# Altium schematic sheet MCU.SchDoc
size A4; SheetNumber: 1; SheetTotal: 4
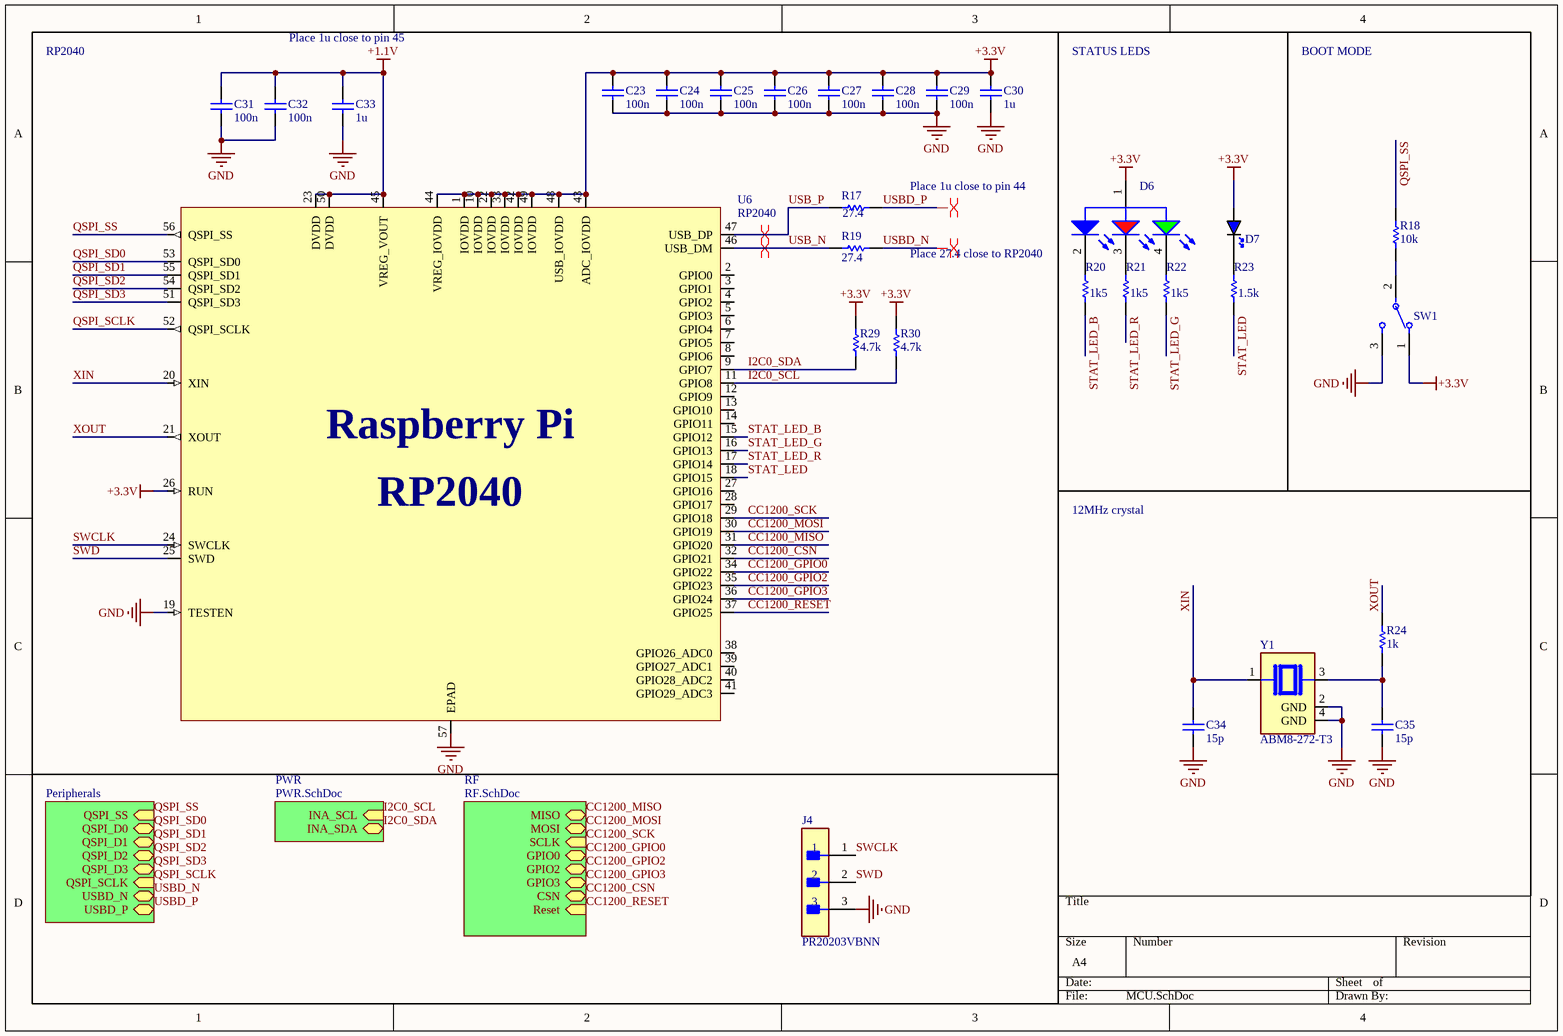
[diagram p0: MCU.SchDoc]

## Parts
C23  value 100n  [RES_0805]  (hidden comment: Capacitor)
C24  value 100n  [RES_0805]  (hidden comment: Capacitor)
C25  value 100n  [RES_0805]  (hidden comment: Capacitor)
C26  value 100n  [RES_0805]  (hidden comment: Capacitor)
C27  value 100n  [RES_0805]  (hidden comment: Capacitor)
C28  value 100n  [RES_0805]  (hidden comment: Capacitor)
C29  value 100n  [RES_0805]  (hidden comment: Capacitor)
C30  value 1u  [RES_0805]  (hidden comment: Capacitor)
C31  value 100n  [RES_0805]  (hidden comment: Capacitor)
C32  value 100n  [RES_0805]  (hidden comment: Capacitor)
C33  value 1u  [RES_0805]  (hidden comment: Capacitor)
C34  value 15p  [RES_0805]  (hidden comment: Capacitor)
C35  value 15p  [RES_0805]  (hidden comment: Capacitor)
D6  150141M173100  [WL-SFTW_3528_150141M173100]  (value not drawn)
D7  BLUE  [LED_0805_BLUE]  (value not drawn)
J4  PR20203VBNN  [FP-PR20203VBNN-MFG]
R17  value 27.4  [RES_0805]  (hidden comment: Resistor)
R18  value 10k  [RES_0603]  (hidden comment: Resistor)
R19  value 27.4  [RES_0805]  (hidden comment: Resistor)
R20  value 1k5  [RES_0805]  (hidden comment: Resistor)
R21  value 1k5  [RES_0805]  (hidden comment: Resistor)
R22  value 1k5  [RES_0805]  (hidden comment: Resistor)
R23  value 1.5k  [RES_0805]  (hidden comment: Resistor)
R24  value 1k  [RES_0805]  (hidden comment: Resistor)
R29  value 4.7k  [RES_0805]  (hidden comment: Resistor)
R30  value 4.7k  [RES_0805]  (hidden comment: Resistor)
SW1  JS102011SAQN  [FP-JS102011SAQN-MFG]  (value not drawn)
U6  RP2040  [QFN-56-EP]
Y1  ABM8-272-T3  [XTAL_ABM8-272-T3]

## Sub-sheets
Peripherals = Peripherals.SchDoc: QSPI_SS (in), QSPI_D0 (bidir), QSPI_D1 (bidir), QSPI_D2 (bidir), QSPI_SCLK (in), QSPI_D3 (bidir), USBD_N (bidir), USBD_P (bidir)
PWR = PWR.SchDoc: INA_SCL (in), INA_SDA (bidir)
RF = RF.SchDoc: MISO (bidir), MOSI (bidir), SCLK (in), GPIO0 (bidir), GPIO2 (bidir), GPIO3 (bidir), CSN (bidir), Reset (in)

## Nets
+1.1V: C31.1 C32.1 C33.1 U6.23(DVDD) U6.45(VREG_VOUT) U6.50(DVDD)
+3.3V: C23.1 C24.1 C25.1 C26.1 C27.1 C28.1 C29.1 C30.1 D6.1(A) D7.A R29.2 R30.2 SW1.1 U6.1(IOVDD) U6.10(IOVDD) U6.22(IOVDD) U6.26(RUN) U6.33(IOVDD) U6.42(IOVDD) U6.43(ADC_IOVDD) U6.44(VREG_IOVDD) U6.48(USB_IOVDD) U6.49(IOVDD)
GND: C23.2 C24.2 C25.2 C26.2 C27.2 C28.2 C29.2 C30.2 C31.2 C32.2 C33.2 C34.2 C35.2 J4.3 SW1.3 U6.19(TESTEN) U6.57(EPAD) Y1.2(GND) Y1.4(GND)
CC1200_CSN: U6.32(GPIO21) ; sheet RF/CSN
CC1200_GPIO0: U6.34(GPIO22) ; sheet RF/GPIO0
CC1200_GPIO2: U6.35(GPIO23) ; sheet RF/GPIO2
CC1200_GPIO3: U6.36(GPIO24) ; sheet RF/GPIO3
CC1200_MISO: U6.31(GPIO20) ; sheet RF/MISO
CC1200_MOSI: U6.30(GPIO19) ; sheet RF/MOSI
CC1200_RESET: U6.37(GPIO25) ; sheet RF/Reset
CC1200_SCK: U6.29(GPIO18) ; sheet RF/SCLK
I2C0_SCL: R30.1 U6.11(GPIO8) ; sheet PWR/INA_SCL
I2C0_SDA: R29.1 U6.9(GPIO7) ; sheet PWR/INA_SDA
QSPI_SCLK: U6.52(QSPI_SCLK) ; sheet Peripherals/QSPI_SCLK
QSPI_SD0: U6.53(QSPI_SD0) ; sheet Peripherals/QSPI_D0
QSPI_SD1: U6.55(QSPI_SD1) ; sheet Peripherals/QSPI_D1
QSPI_SD2: U6.54(QSPI_SD2) ; sheet Peripherals/QSPI_D2
QSPI_SD3: U6.51(QSPI_SD3) ; sheet Peripherals/QSPI_D3
QSPI_SS: R18.1 U6.56(QSPI_SS) ; sheet Peripherals/QSPI_SS
STAT_LED: R23.2 U6.18(GPIO15)
STAT_LED_B: R20.2 U6.15(GPIO12)
STAT_LED_G: R22.2 U6.16(GPIO13)
STAT_LED_R: R21.2 U6.17(GPIO14)
SWCLK: J4.1 U6.24(SWCLK)
SWD: J4.2 U6.25(SWD)
USB_N: R19.1 U6.46(USB_DM)
USB_P: R17.1 U6.47(USB_DP)
USBD_N: R19.2 ; sheet Peripherals/USBD_N
USBD_P: R17.2 ; sheet Peripherals/USBD_P
XIN: C34.1 U6.20(XIN) Y1.1
XOUT: R24.2 U6.21(XOUT)
NetC35_1: C35.1 R24.1 Y1.3
NetD6_2: D6.2(K) R20.1
NetD6_3: D6.3(K) R21.1
NetD6_4: D6.4(K) R22.1
NetD7_K: D7.K R23.1
NetR18_2: R18.2 SW1.2(C)

Not connected (* = marked no-connect by the designer): U6 2(GPIO0) 3(GPIO1) 4(GPIO2) 5(GPIO3) 6(GPIO4) 7(GPIO5) 8(GPIO6) 12(GPIO9) 13(GPIO10) 14(GPIO11) 27(GPIO16) 28(GPIO17) 38(GPIO26_ADC0) 39(GPIO27_ADC1) 40(GPIO28_ADC2) 41(GPIO29_ADC3)

## Layout directives
differential pair: USB_N, USB_P, USBD_N, USBD_P

## Notes on the sheet
- Place 1u close to pin 45
- RP2040
- STATUS LEDS
- BOOT MODE
- Place 1u close to pin 44
- Place 27.4 close to RP2040
- 12MHz crystal

## Library data of the parts
C23-C35 = Capacitor: SimulationGenericComponent: True
D6 = CMP-1431-00001-2: NexarPartId: 29717795; Forward Current: 100mA; Peak Wavelength: 465nm; Viewing Angle: 120°; Color: Green, Red; Max Reverse Voltage (DC): 5V; Forward Voltage: 3.2V; Dominant Wavelength: 520nm; Test Current: 20mA; Power Dissipation: 72mW; Wavelength: 470nm; Lens Style: Clear, Round; Luminous Intensity: 230mcd; Case/Package: 1411; Packaging: Tape and Reel; Case Code (Metric): 3528; Min Operating Temperature: -40°C; Length: 3.5mm; Number of Pins: 4; Width: 2.8mm; Max Operating Temperature: 85°C; Case Code (Imperial): 1411; Height: 1.9mm; REACH SVHC: Unknown; Mount: Surface Mount; RoHS: Compliant
D7 = LED_0805_BLUE: LED 0805 BLUE SMD; Manufacturer: *; Manufacturer Part Number: *; Distributor Link: *; LCSC: *
J4 = CMP-77940-000002-1: CONN HEADER VERT 3POS 2.54MM; Manufacturer: Metz Connect; Conn Orientation: Straight; Current Rating: 3A; Number Of Contacts: 3; Conn Gender: Male; Temperature: -40°C to +105°C; Pitch: 2.54mm; Device Class L1: Connectors; Digikey Description: CONN HEADER VERT 3POS 2.54MM; ComponentLink2URL: https://datasheet.octopart.com/PR20203VBNN-Metz-Connect-datasheet-101610322.pdf; Height: 8.6mm; Temperature Range High: +105°C; Manufacturer Part Number: PR20203VBNN; Number Of Rows: 1; Octopart: https://octopart.com/pr20203vbnn-metz+connect-87667116; Device Class L3: unset; ComponentLink2Description: Datasheet; Device Class L2: Headers and Wire Housings; Temperature Range Low: -40°C; Automotive: No; Contact Material: Gold,Nickel; Category: Conn; Lead Free: Yes; RoHS: TRUE; Package: PR20203VBNN
R17-R24 R29 R30 = Resistor: TC1: 0; SimulationGenericComponent: True; TC2: 0
SW1 = CMP-2000-06501-2: SWITCH SLIDE SPDT 300MA 6V; Switch Function: On-On; Illumination Type: Non-Illuminated; Switch Travel: 2mm; Contact Resistance: 70mR; Actuator Material: Nylon; Electrical Life: 5000Cycles; Actuator Type: Standard; Max Operating Temperature: 85°C; Housing Material: Nylon; Radiation Hardening: No; Max Voltage Rating (DC): 6V; Package Quantity: 1; Case/Package: 100; Actuator Length: 2mm; Min Operating Temperature: -40°C; Contact Current Rating: 300mA; REACH SVHC: No SVHC; Throw Configuration: SPDT; Packaging: Tape and Reel; Contact Material: Copper Alloy; Max Current Rating: 300mA; Current Rating: 300mA; Mount: Surface Mount; Lead Free: Lead Free; Termination: Gull Wing; Voltage Rating (DC): 6V; Length: 9mm; Orientation: Right Angle; Contact Plating: Silver
U6 = RP2040: 32-Bit Dual-Core ARM Cortex-M0+ Microcontroller; Manufacturer: Raspberry Pi; Manufacturer Part Number: RP2040
Y1 = ABM8-272-T3: 12 MHz Â±30ppm Crystal 10pF 50 Ohms 4-SMD, No Lead; MF: ABRACON; SnapEDA_Link: https://www.snapeda.com/parts/ABM8-272-T3/Abracon/view-part/?ref=snap; Package: NON-STANDARD-4 Abracon; Value: *; MP: ABM8-272-T3; Check_prices: https://www.snapeda.com/parts/ABM8-272-T3/Abracon/view-part/?ref=eda